# Altium project StereoJackAdapter.PrjPCB
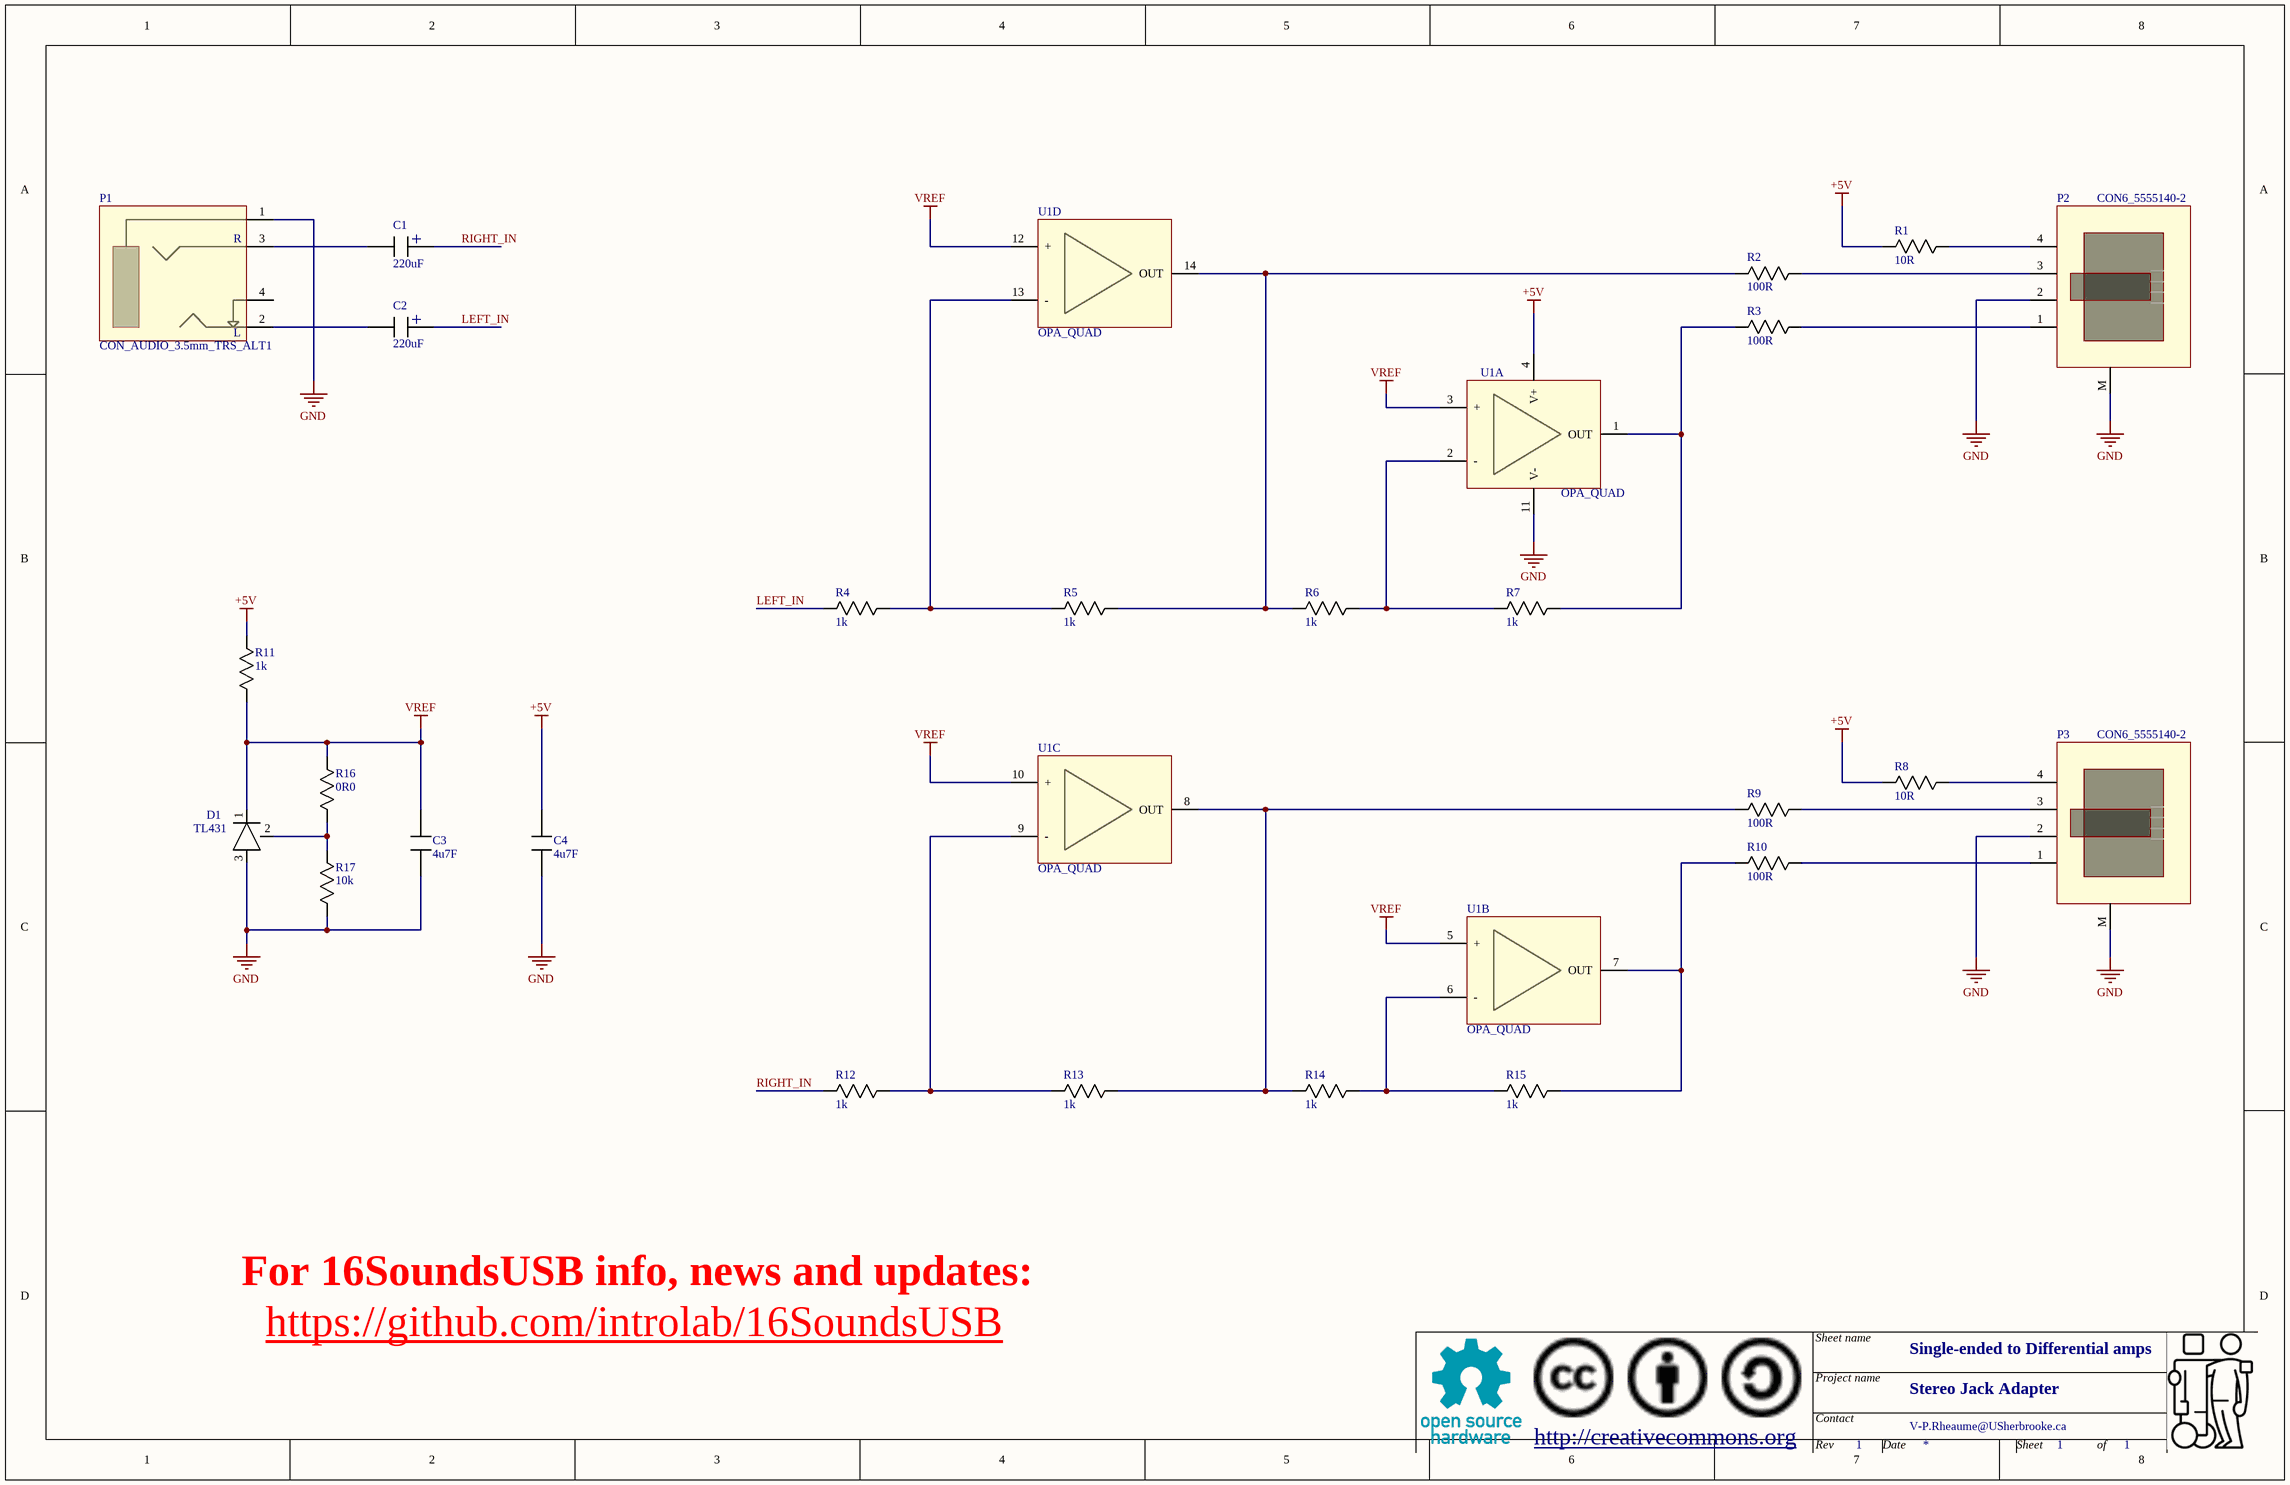
[diagram p0: StereoJackToDualDifferential.SchDoc]
RevisionGlobal: 1; ProjectTitle: Stereo Jack Adapter; DrawnByGlobal: V-P.Rheaume@USherbrooke.ca
1 sheet, 26 parts. Net scope: global (net labels, ports and power ports of the same name join across sheets).
Board file: StereoJackToDualDifferential.PcbDoc

## Sheet StereoJackToDualDifferential.SchDoc
size Tabloid; DocumentNumber: 1; SheetNumber: 1; SheetTotal: 1; SheetName: Single-ended to Differential amps

### Parts
C1  value 220uF  [CAP_RAD_SMD_DIA315]  (hidden comment: Capacitor_Polarized)
C2  value 220uF  [CAP_RAD_SMD_DIA315]  (hidden comment: Capacitor_Polarized)
C3  value 4u7F  [0805]  (hidden comment: Capacitor)
C4  value 4u7F  [0805]  (hidden comment: Capacitor)
D1  TL431  [SOT23_132]
P1  CON_AUDIO_3.5mm_TRS_ALT1  [CONN_3.5mm_CUI 3523-SMT]
P2  CON6_5555140-2  [CONN4_5555140-2]
P3  CON6_5555140-2  [CONN4_5555140-2]
R1  value 10R  [0805]  (hidden comment: Resistor)
R2  value 100R  [0805]  (hidden comment: Resistor)
R3  value 100R  [0805]  (hidden comment: Resistor)
R4  value 1k  [0805]  (hidden comment: Resistor)
R5  value 1k  [0805]  (hidden comment: Resistor)
R6  value 1k  [0805]  (hidden comment: Resistor)
R7  value 1k  [0805]  (hidden comment: Resistor)
R8  value 10R  [0805]  (hidden comment: Resistor)
R9  value 100R  [0805]  (hidden comment: Resistor)
R10  value 100R  [0805]  (hidden comment: Resistor)
R11  value 1k  [0805]  (hidden comment: Resistor)
R12  value 1k  [0805]  (hidden comment: Resistor)
R13  value 1k  [0805]  (hidden comment: Resistor)
R14  value 1k  [0805]  (hidden comment: Resistor)
R15  value 1k  [0805]  (hidden comment: Resistor)
R16  value 0R0  [0805]  (hidden comment: Resistor)
R17  value 10k  [0805]  (hidden comment: Resistor)
U1  OPA_QUAD  [TSSOP14]  (parts A,B,C,D of 4)

### Nets
+5V: C4.1 R1.2 R8.2 R11.2 U1.4(V+)
GND: C3.2 C4.2 D1.3 P1.1 P2.2 P2.M P3.2 P3.M R17.1 U1.11(V-)
VREF: C3.1 D1.1 R11.1 R16.2 U1.3(+) U1.5(+) U1.10(+) U1.12(+)
LEFT_IN: C2.+ R4.2
RIGHT_IN: C1.+ R12.2
NetC1_-: C1.- P1.3(R)
NetC2_-: C2.- P1.2(L)
NetD1_2: D1.2 R16.1 R17.2
NetP2_1: P2.1 R3.2
NetP2_3: P2.3 R2.2
NetP2_4: P2.4 R1.1
NetP3_1: P3.1 R10.2
NetP3_3: P3.3 R9.2
NetP3_4: P3.4 R8.1
NetR2_1: R2.1 R5.1 R6.1 U1.14(OUT)
NetR3_1: R3.1 R7.2 U1.1(OUT)
NetR4_1: R4.1 R5.2 U1.13(-)
NetR6_2: R6.2 R7.1 U1.2(-)
NetR9_1: R9.1 R13.1 R14.1 U1.8(OUT)
NetR10_1: R10.1 R15.2 U1.7(OUT)
NetR12_1: R12.1 R13.2 U1.9(-)
NetR14_2: R14.2 R15.1 U1.6(-)

Not connected (* = marked no-connect by the designer): P1 4(NC_L)

### Notes on the sheet
- For 16SoundsUSB info, news and updates:
- https://github.com/introlab/16SoundsUSB
- Sheet name
- http://creativecommons.org
- Project name
- Contact
- Rev
- Date
- Sheet
- of

### Library data of the parts
C1 C2 = Capacitor_Polarized: Capacitor; Mfg: Nichicon; Mfg_PN: UWX1A221MCL1GB; HelpURL: *; NI: *; Supplier1: Digikey; Supplier1_PN: 493-2098-1-ND; Tolerance: *; Type: *; Rating: *
C3 C4 = Capacitor: Mfg: Wurth; Mfg_PN: 885012107013; HelpURL: *; NI: *; Supplier1: Digikey; Supplier1_PN: 732-7623-1-ND; Tolerance: *; Type: *; Rating: *
D1 = TL431: Mfg: NXP; Mfg_PN: TL431AQDBZR,215; HelpURL: *; NI: *; Supplier1: Digikey; Supplier1_PN: 568-4890-1-ND; Tolerance: *; Type: *; Rating: *; Value: *
P1 = CON_AUDIO_3.5mm_TRS_ALT1: Audio 3.5mm CUI SJ-3523-SMT-TR; HelpURL: *; Mfg: CUI; Mfg_PN: SJ-3523-SMT-TR; NI: *; Rating: *; Supplier1: Digikey; Supplier1_PN: CP-3523SJCT-ND; Tolerance: *; Type: *; Value: *
P2 P3 = CON6_5555140-2: 6p4c RJ11/RJ14, shielded (5555165-2 unshielded); Mfg: TE; HelpURL: *; Mfg_PN: 5555140-2; NI: *; Rating: *; Supplier1: Digikey; Supplier1_PN: A31436-ND; Tolerance: *; Type: *; Value: *
R1 R8 = Resistor: Mfg: Stackpole; Mfg_PN: RMCF0805JG10R0; HelpURL: *; NI: *; Supplier1: Digikey; Supplier1_PN: RMCF0805JG10R0CT-ND; Type: *; Rating: *; Tolerance: *
R2 R3 R9 R10 = Resistor: Mfg: Stackpole; Mfg_PN: RMCF0805JT100R; HelpURL: *; NI: *; Supplier1: Digikey; Supplier1_PN: RMCF0805JT100RCT-ND; Type: *; Rating: *; Tolerance: *
R4-R7 R11-R15 = Resistor: Mfg: Stackpole; Mfg_PN: RMCF0805JT1K00; HelpURL: *; NI: *; Supplier1: Digikey; Supplier1_PN: RMCF0805JT1K00CT-ND; Type: *; Rating: *; Tolerance: *
R16 = Resistor: Mfg: Bourns; Mfg_PN: CR0805-J/-000ELF; HelpURL: *; NI: *; Supplier1: Digikey; Supplier1_PN: CR0805-J/-000ELFCT-ND; Type: *; Rating: *; Tolerance: *
R17 = Resistor: Mfg: Stackpole; Mfg_PN: RMCF0805JT10K0; HelpURL: *; NI: *; Supplier1: Digikey; Supplier1_PN: RMCF0805JT10K0CT-ND; Type: *; Rating: *; Tolerance: *
U1 = OPA_QUAD: Quad amplifier (standard); Mfg: Microchip; Mfg_PN: MCP6024-I/ST; HelpURL: *; NI: *; Rating: *; Supplier1: Digikey; Supplier1_PN: MCP6024-I/ST-ND; Tolerance: *; Value: *